# Altium schematic sheet MEAS_CPU.SchDoc
size A3
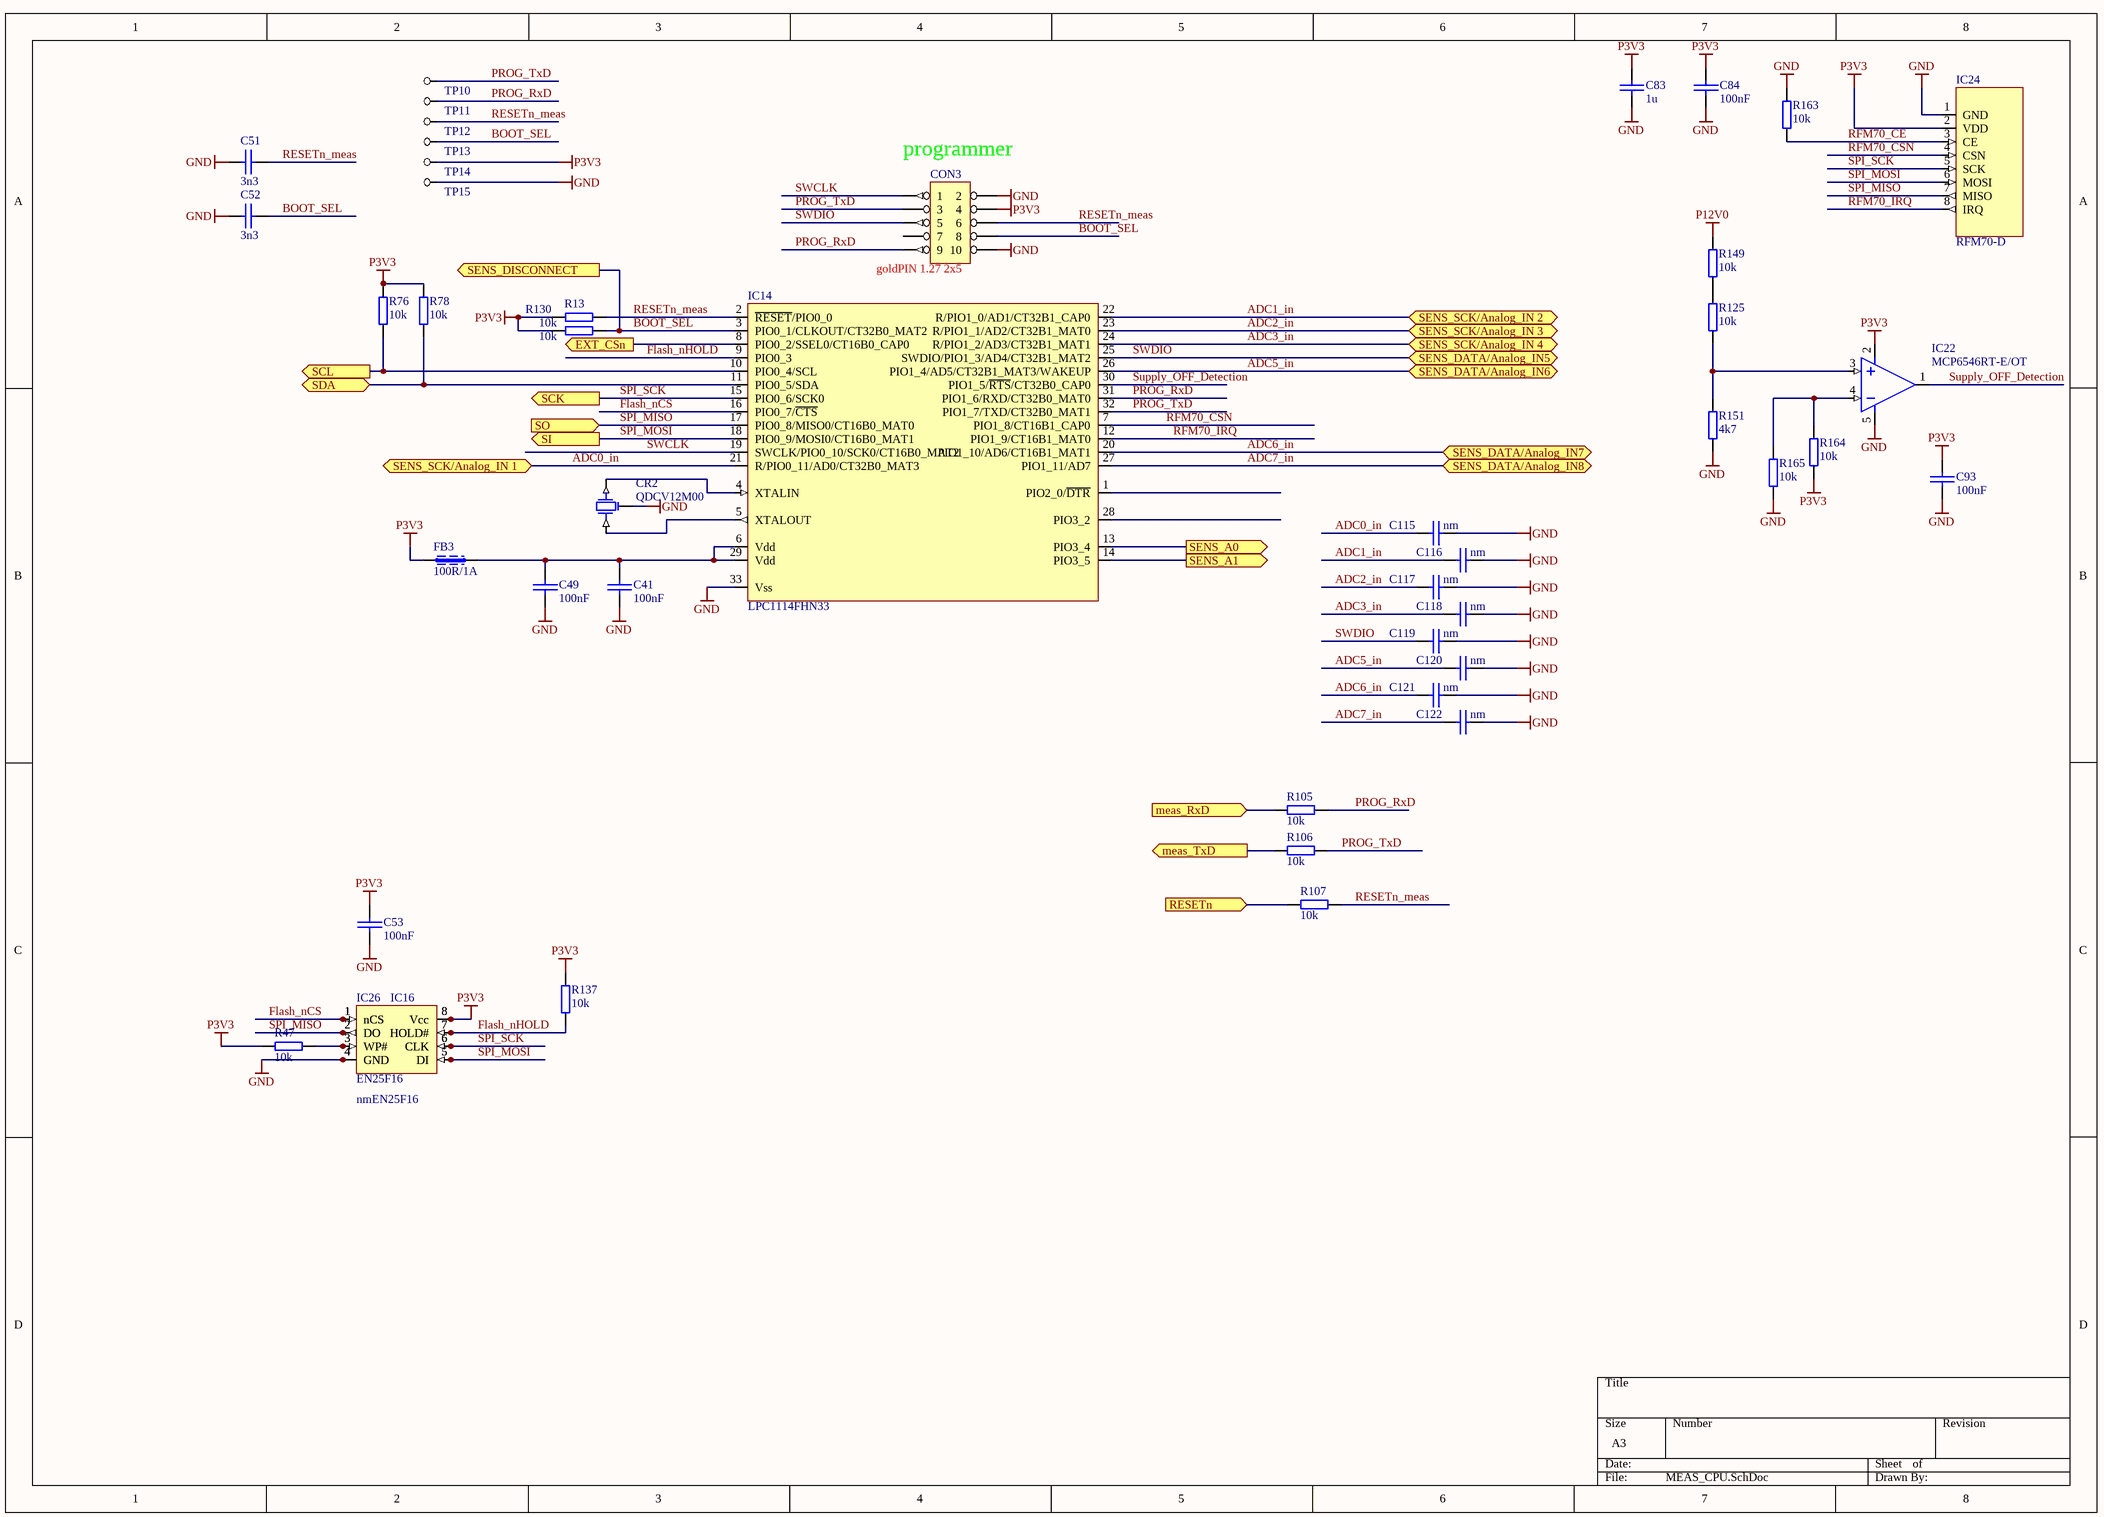
[diagram p0: MEAS_CPU.SchDoc]

## Parts
C41  100nF  [0402C]
C49  100nF  [0402C]
C51  3n3  [0603C]
C52  3n3  [0603C]
C53  100nF  [0402C]
C83  1u  [0603C]
C84  100nF  [0402C]
C93  100nF  [0402C]
C115  nm  [0402C]
C116  nm  [0402C]
C117  nm  [0402C]
C118  nm  [0402C]
C119  nm  [0402C]
C120  nm  [0402C]
C121  nm  [0402C]
C122  nm  [0402C]
CON3  goldPIN 1.27 2x5  [CON_2x5_MINI]
CR2  QDCV12M00  [CERAMIC_RES_QDCV]
FB3  100R/1A  [0603L]
IC14  LPC1114FHN33  [HVQFN33_QFN127P600-8N]
IC16  EN25F16  [SO-8]
IC22  MCP6546RT-E/OT  [SOT23-5]
IC24  RFM70-D  [RFM70-D]
IC26  nmEN25F16  [SO-8L]
R13  10k  [0402R]
R47  10k  [0402R]
R76  10k  [0402R]
R78  10k  [0402R]
R105  10k  [0402R]
R106  10k  [0402R]
R107  10k  [0402R]
R125  10k  [0402R]
R130  10k  [0402R]
R137  10k  [0402R]
R149  10k  [0402R]
R151  4k7  [0402R]
R163  10k  [0402R]
R164  10k  [0402R]
R165  10k  [0402R]
TP10  TP_PROG_TxD  [TP_large]  (value not drawn)
TP11  TP_PROG_RxD  [TP_large]  (value not drawn)
TP12  TP_RESETn  [TP_large]  (value not drawn)
TP13  TP_BOOT_SEL  [TP_large]  (value not drawn)
TP14  TP_3V3_meas  [TP_large]  (value not drawn)
TP15  TP_GND_meas  [TP_large]  (value not drawn)

## Ports
EXT_CSn (out), meas_RxD (in), meas_TxD (out), RESETn (in), SCK (out), SCL (out), SDA (bidir), SENS_A0 (out), SENS_A1 (out), SENS_DATA/Analog_IN5 (bidir), SENS_DATA/Analog_IN6 (bidir), SENS_DATA/Analog_IN7 (bidir), SENS_DATA/Analog_IN8 (bidir), SENS_DISCONNECT (out), SENS_SCK/Analog_IN 1 (bidir), SENS_SCK/Analog_IN 2 (bidir), SENS_SCK/Analog_IN 3 (bidir), SENS_SCK/Analog_IN 4 (bidir), SI (out), SO (in)

## Nets
GND: C41.2 C49.2 C51.1 C52.1 C53.2 C83.2 C84.1 C93.1 C115.1 C116.1 C117.1 C118.1 C119.1 C120.1 C121.1 C122.1 CON3.2 CON3.10 CR2.2 IC14.33(Vss) IC16.4(GND) IC22.5 IC24.1(GND) IC26.4(GND) R151.1 R163.1 R165.1 TP15.1
P3V3: C53.1 C83.1 C84.2 C93.2 CON3.4 FB3.1 IC16.8(Vcc) IC22.2 IC24.2(VDD) IC26.8(Vcc) R13.1 R47.2 R76.2 R78.2 R130.1 R137.1 R164.1 TP14.1
P12V0: R149.2
ADC0_in: C115.2 IC14.21(R/PIO0_11/AD0/CT32B0_MAT3) ; port SENS_SCK/Analog_IN 1
ADC1_in: C116.2 IC14.22(R/PIO1_0/AD1/CT32B1_CAP0) ; port SENS_SCK/Analog_IN 2
ADC2_in: C117.2 IC14.23(R/PIO1_1/AD2/CT32B1_MAT0) ; port SENS_SCK/Analog_IN 3
ADC3_in: C118.2 IC14.24(R/PIO1_2/AD3/CT32B1_MAT1) ; port SENS_SCK/Analog_IN 4
ADC5_in: C120.2 IC14.26(PIO1_4/AD5/CT32B1_MAT3/WAKEUP) ; port SENS_DATA/Analog_IN6
ADC6_in: C121.2 IC14.20(PIO1_10/AD6/CT16B1_MAT1) ; port SENS_DATA/Analog_IN7
ADC7_in: C122.2 IC14.27(PIO1_11/AD7) ; port SENS_DATA/Analog_IN8
BOOT_SEL: C52.2 CON3.8 IC14.3(PIO0_1/CLKOUT/CT32B0_MAT2) R130.2 TP13.1 ; port SENS_DISCONNECT
EXT_CSn: IC14.8(PIO0_2/SSEL0/CT16B0_CAP0) ; port EXT_CSn
Flash_nCS: IC14.16(PIO0_7/~{CTS}) IC16.1(nCS) IC26.1(nCS)
Flash_nHOLD: IC14.9(PIO0_3) IC16.7(HOLD#) IC26.7(HOLD#) R137.2
meas_RxD: R105.1 ; port meas_RxD
meas_TxD: R106.1 ; port meas_TxD
PROG_RxD: CON3.9 IC14.31(PIO1_6/RXD/CT32B0_MAT0) R105.2 TP11.1
PROG_TxD: CON3.3 IC14.32(PIO1_7/TXD/CT32B0_MAT1) R106.2 TP10.1
RESETn: R107.1 ; port RESETn
RESETn_meas: C51.2 CON3.6 IC14.2(~{RESET}/PIO0_0) R13.2 R107.2 TP12.1
RFM70_CE: IC24.3(CE) R163.2
RFM70_CSN: IC14.7(PIO1_8/CT16B1_CAP0) IC24.4(CSN)
RFM70_IRQ: IC14.12(PIO1_9/CT16B1_MAT0) IC24.8(IRQ)
SCL: IC14.10(PIO0_4/SCL) R76.1 ; port SCL
SDA: IC14.11(PIO0_5/SDA) R78.1 ; port SDA
SENS_A0: IC14.13(PIO3_4) ; port SENS_A0
SENS_A1: IC14.14(PIO3_5) ; port SENS_A1
SPI_MISO: IC14.17(PIO0_8/MISO0/CT16B0_MAT0) IC16.2(DO) IC24.7(MISO) IC26.2(DO) ; port SO
SPI_MOSI: IC14.18(PIO0_9/MOSI0/CT16B0_MAT1) IC16.5(DI) IC24.6(MOSI) IC26.5(DI) ; port SI
SPI_SCK: IC14.15(PIO0_6/SCK0) IC16.6(CLK) IC24.5(SCK) IC26.6(CLK) ; port SCK
Supply_OFF_Detection: IC14.30(PIO1_5/~{RTS}/CT32B0_CAP0) IC22.1
SWCLK: CON3.1 IC14.19(SWCLK/PIO0_10/SCK0/CT16B0_MAT2)
SWDIO: C119.2 CON3.5 IC14.25(SWDIO/PIO1_3/AD4/CT32B1_MAT2) ; port SENS_DATA/Analog_IN5
NetC41_1: C41.1 C49.1 FB3.2 IC14.6(Vdd) IC14.29(Vdd)
NetCR2_1: CR2.1 IC14.4(XTALIN)
NetCR2_3: CR2.3 IC14.5(XTALOUT)
NetIC16_3: IC16.3(WP#) IC26.3(WP#) R47.1
NetIC22_3: IC22.3 R125.1 R151.2
NetIC22_4: IC22.4 R164.2 R165.2
NetR125_2: R125.2 R149.1

Not connected (* = marked no-connect by the designer): CON3 7; IC14 1(PIO2_0/~{DTR}) 28(PIO3_2)

## Notes on the sheet
- (near CON3) programmer

## Library data of the parts
C41 C49 C53 C84 C93 C115-C122 = CAP_SMD_0402: Capacitor SMD; Supplier 1: Newark; Supplier Part Number 1: 14T3275
C51 C52 C83 = CAP_SMD_0603: Capacitor SMD
CON3 = HEADER 5X2
CR2 = X_CERAMIC_RES: ceramic resonator QCC(QDCV)12.00 (Maritex)
FB3 = L_FERRITE_BEAD: ferrite bead
IC14 = UPC_LPC1111
IC16 IC26 = MEM_EN25F16: FLASH (maritex)
IC22 = CMP_MCP6546RT-E/OT: Open-Drain Output Sub-Microamp Comparators
IC24 = RFM70-D: Low Power High Performance 2.4 GHz GFSK Transceiver Module
R13 R47 R76 R78 R105-R107 R125 R130 R137 R149 R151 R163-R165 = RES_0402: SMD Resistor; Supplier 1: Newark; Supplier Part Number 1: 59M6691
TP10-TP15 = TP: Testpoint